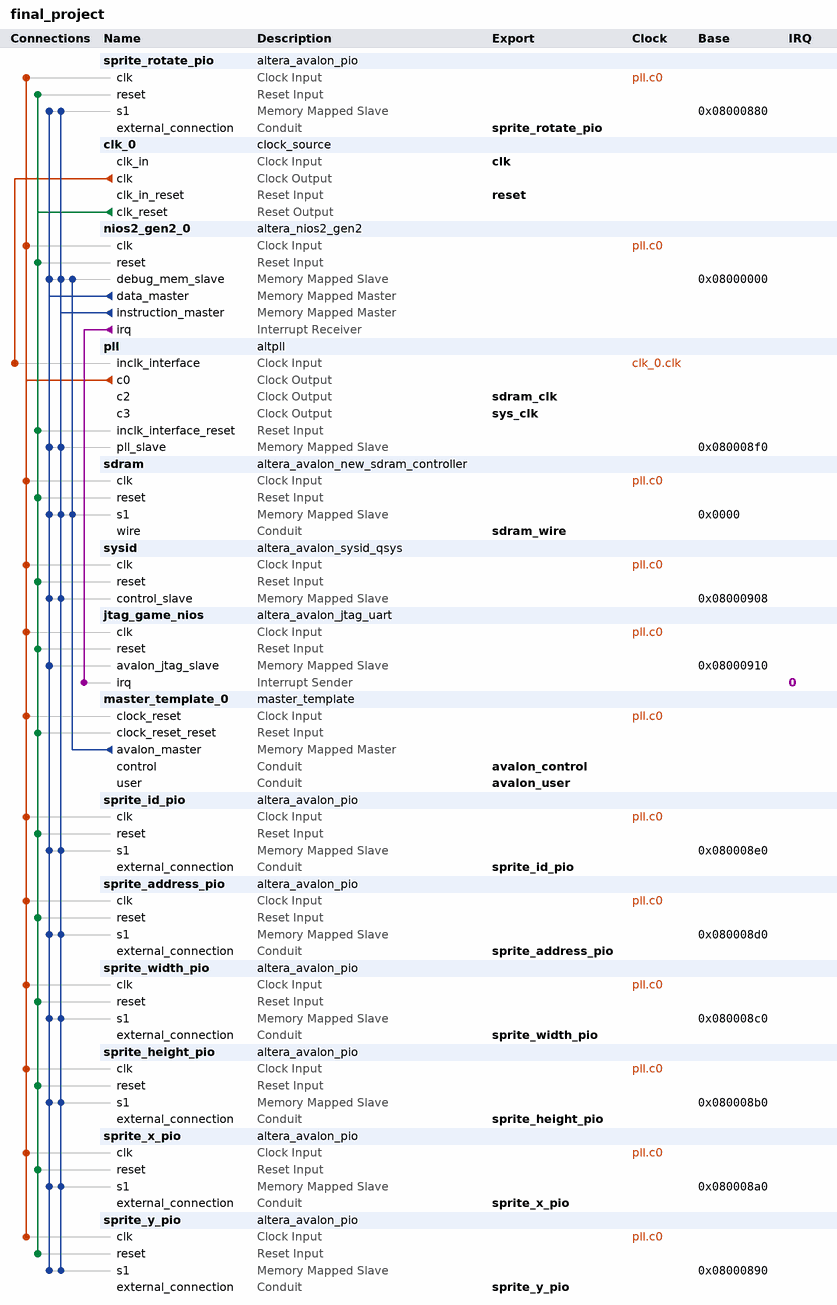
[diagram p0: system contents]
# Platform Designer (Qsys) system final_project, Cyclone IV E EP4CE115F29C7
# Parameters at their usual value, and those the tool derives, are not listed.
package require -exact qsys 18.1
create_system final_project
set_project_property DEVICE_FAMILY {Cyclone IV E}
set_project_property DEVICE EP4CE115F29C7

add_instance sprite_rotate_pio altera_avalon_pio 18.1
set_instance_parameter_value sprite_rotate_pio direction Output
set_instance_parameter_value sprite_rotate_pio width 8

add_instance clk_0 clock_source 18.1
set_instance_parameter_value clk_0 clockFrequency 50000000

add_instance nios2_gen2_0 altera_nios2_gen2 18.1
set_instance_parameter_value nios2_gen2_0 dcache_size 4096
set_instance_parameter_value nios2_gen2_0 exceptionSlave sdram.s1
set_instance_parameter_value nios2_gen2_0 icache_size 4096
set_instance_parameter_value nios2_gen2_0 impl Tiny
set_instance_parameter_value nios2_gen2_0 resetSlave sdram.s1

add_instance pll altpll 18.1
set_instance_parameter_value pll BANDWIDTH_TYPE LOW
set_instance_parameter_value pll CLK0_DIVIDE_BY 1
set_instance_parameter_value pll CLK0_MULTIPLY_BY 2
set_instance_parameter_value pll CLK1_DIVIDE_BY 2
set_instance_parameter_value pll CLK1_DUTY_CYCLE 50
set_instance_parameter_value pll CLK1_MULTIPLY_BY 3
set_instance_parameter_value pll CLK1_PHASE_SHIFT 0
set_instance_parameter_value pll CLK2_DIVIDE_BY 1
set_instance_parameter_value pll CLK2_DUTY_CYCLE 50
set_instance_parameter_value pll CLK2_MULTIPLY_BY 2
set_instance_parameter_value pll CLK2_PHASE_SHIFT -4000
set_instance_parameter_value pll CLK3_DIVIDE_BY 1
set_instance_parameter_value pll CLK3_DUTY_CYCLE 50
set_instance_parameter_value pll CLK3_MULTIPLY_BY 2
set_instance_parameter_value pll CLK3_PHASE_SHIFT 0
set_instance_parameter_value pll INCLK0_INPUT_FREQUENCY 20000
set_instance_parameter_value pll PORT_ARESET PORT_UNUSED
set_instance_parameter_value pll PORT_LOCKED PORT_UNUSED
set_instance_parameter_value pll PORT_clk1 PORT_USED
set_instance_parameter_value pll PORT_clk2 PORT_USED
set_instance_parameter_value pll PORT_clk3 PORT_USED

add_instance sdram altera_avalon_new_sdram_controller 18.1
set_instance_parameter_value sdram TAC 5.5
set_instance_parameter_value sdram TRCD 20.0
set_instance_parameter_value sdram TRP 20.0
set_instance_parameter_value sdram casLatency 3
set_instance_parameter_value sdram columnWidth 10
set_instance_parameter_value sdram dataWidth 32
set_instance_parameter_value sdram generateSimulationModel false
set_instance_parameter_value sdram model single_Micron_MT48LC4M32B2_7_chip
set_instance_parameter_value sdram numberOfBanks 4
set_instance_parameter_value sdram numberOfChipSelects 1
set_instance_parameter_value sdram powerUpDelay 200.0
set_instance_parameter_value sdram refreshPeriod 7.8125
set_instance_parameter_value sdram rowWidth 13

add_instance sysid altera_avalon_sysid_qsys 18.1
set_instance_parameter_value sysid id 0

add_instance jtag_game_nios altera_avalon_jtag_uart 18.1
set_instance_parameter_value jtag_game_nios simInteractiveOptions NO_INTERACTIVE_WINDOWS

add_instance master_template_0 master_template 1.0
set_instance_parameter_value master_template_0 ADDRESS_WIDTH 32
set_instance_parameter_value master_template_0 BURST_CAPABLE 1
set_instance_parameter_value master_template_0 DATA_WIDTH 8
set_instance_parameter_value master_template_0 FIFO_DEPTH 256
set_instance_parameter_value master_template_0 MASTER_DIRECTION 0
set_instance_parameter_value master_template_0 MAXIMUM_BURST_COUNT 128
set_instance_parameter_value master_template_0 MEMORY_BASED_FIFO 1

add_instance sprite_id_pio altera_avalon_pio 18.1
set_instance_parameter_value sprite_id_pio direction Output
set_instance_parameter_value sprite_id_pio width 16

add_instance sprite_address_pio altera_avalon_pio 18.1
set_instance_parameter_value sprite_address_pio direction Output
set_instance_parameter_value sprite_address_pio width 32

add_instance sprite_width_pio altera_avalon_pio 18.1
set_instance_parameter_value sprite_width_pio direction Output
set_instance_parameter_value sprite_width_pio width 16

add_instance sprite_height_pio altera_avalon_pio 18.1
set_instance_parameter_value sprite_height_pio direction Output
set_instance_parameter_value sprite_height_pio width 16

add_instance sprite_x_pio altera_avalon_pio 18.1
set_instance_parameter_value sprite_x_pio direction Output
set_instance_parameter_value sprite_x_pio width 16

add_instance sprite_y_pio altera_avalon_pio 18.1
set_instance_parameter_value sprite_y_pio direction Output
set_instance_parameter_value sprite_y_pio width 16

# connections
add_connection clk_0.clk pll.inclk_interface clock
add_connection pll.c0 jtag_game_nios.clk clock
add_connection pll.c0 master_template_0.clock_reset clock
add_connection pll.c0 nios2_gen2_0.clk clock
add_connection pll.c0 sdram.clk clock
add_connection pll.c0 sprite_address_pio.clk clock
add_connection pll.c0 sprite_height_pio.clk clock
add_connection pll.c0 sprite_id_pio.clk clock
add_connection pll.c0 sprite_rotate_pio.clk clock
add_connection pll.c0 sprite_width_pio.clk clock
add_connection pll.c0 sprite_x_pio.clk clock
add_connection pll.c0 sprite_y_pio.clk clock
add_connection pll.c0 sysid.clk clock
add_connection clk_0.clk_reset jtag_game_nios.reset reset
add_connection clk_0.clk_reset master_template_0.clock_reset_reset reset
add_connection clk_0.clk_reset nios2_gen2_0.reset reset
add_connection clk_0.clk_reset pll.inclk_interface_reset reset
add_connection clk_0.clk_reset sdram.reset reset
add_connection clk_0.clk_reset sprite_address_pio.reset reset
add_connection clk_0.clk_reset sprite_height_pio.reset reset
add_connection clk_0.clk_reset sprite_id_pio.reset reset
add_connection clk_0.clk_reset sprite_rotate_pio.reset reset
add_connection clk_0.clk_reset sprite_width_pio.reset reset
add_connection clk_0.clk_reset sprite_x_pio.reset reset
add_connection clk_0.clk_reset sprite_y_pio.reset reset
add_connection clk_0.clk_reset sysid.reset reset
add_connection master_template_0.avalon_master nios2_gen2_0.debug_mem_slave avalon
set_connection_parameter_value master_template_0.avalon_master/nios2_gen2_0.debug_mem_slave baseAddress 0x08000000
add_connection master_template_0.avalon_master sdram.s1 avalon
set_connection_parameter_value master_template_0.avalon_master/sdram.s1 baseAddress 0x0000
add_connection nios2_gen2_0.data_master jtag_game_nios.avalon_jtag_slave avalon
set_connection_parameter_value nios2_gen2_0.data_master/jtag_game_nios.avalon_jtag_slave baseAddress 0x08000910
add_connection nios2_gen2_0.data_master nios2_gen2_0.debug_mem_slave avalon
set_connection_parameter_value nios2_gen2_0.data_master/nios2_gen2_0.debug_mem_slave baseAddress 0x08000000
add_connection nios2_gen2_0.data_master pll.pll_slave avalon
set_connection_parameter_value nios2_gen2_0.data_master/pll.pll_slave baseAddress 0x080008f0
add_connection nios2_gen2_0.data_master sdram.s1 avalon
set_connection_parameter_value nios2_gen2_0.data_master/sdram.s1 baseAddress 0x0000
add_connection nios2_gen2_0.data_master sprite_address_pio.s1 avalon
set_connection_parameter_value nios2_gen2_0.data_master/sprite_address_pio.s1 baseAddress 0x080008d0
add_connection nios2_gen2_0.data_master sprite_height_pio.s1 avalon
set_connection_parameter_value nios2_gen2_0.data_master/sprite_height_pio.s1 baseAddress 0x080008b0
add_connection nios2_gen2_0.data_master sprite_id_pio.s1 avalon
set_connection_parameter_value nios2_gen2_0.data_master/sprite_id_pio.s1 baseAddress 0x080008e0
add_connection nios2_gen2_0.data_master sprite_rotate_pio.s1 avalon
set_connection_parameter_value nios2_gen2_0.data_master/sprite_rotate_pio.s1 baseAddress 0x08000880
add_connection nios2_gen2_0.data_master sprite_width_pio.s1 avalon
set_connection_parameter_value nios2_gen2_0.data_master/sprite_width_pio.s1 baseAddress 0x080008c0
add_connection nios2_gen2_0.data_master sprite_x_pio.s1 avalon
set_connection_parameter_value nios2_gen2_0.data_master/sprite_x_pio.s1 baseAddress 0x080008a0
add_connection nios2_gen2_0.data_master sprite_y_pio.s1 avalon
set_connection_parameter_value nios2_gen2_0.data_master/sprite_y_pio.s1 baseAddress 0x08000890
add_connection nios2_gen2_0.data_master sysid.control_slave avalon
set_connection_parameter_value nios2_gen2_0.data_master/sysid.control_slave baseAddress 0x08000908
add_connection nios2_gen2_0.instruction_master nios2_gen2_0.debug_mem_slave avalon
set_connection_parameter_value nios2_gen2_0.instruction_master/nios2_gen2_0.debug_mem_slave baseAddress 0x08000000
add_connection nios2_gen2_0.instruction_master pll.pll_slave avalon
set_connection_parameter_value nios2_gen2_0.instruction_master/pll.pll_slave baseAddress 0x080008f0
add_connection nios2_gen2_0.instruction_master sdram.s1 avalon
set_connection_parameter_value nios2_gen2_0.instruction_master/sdram.s1 baseAddress 0x0000
add_connection nios2_gen2_0.instruction_master sprite_address_pio.s1 avalon
set_connection_parameter_value nios2_gen2_0.instruction_master/sprite_address_pio.s1 baseAddress 0x080008d0
add_connection nios2_gen2_0.instruction_master sprite_height_pio.s1 avalon
set_connection_parameter_value nios2_gen2_0.instruction_master/sprite_height_pio.s1 baseAddress 0x080008b0
add_connection nios2_gen2_0.instruction_master sprite_id_pio.s1 avalon
set_connection_parameter_value nios2_gen2_0.instruction_master/sprite_id_pio.s1 baseAddress 0x080008e0
add_connection nios2_gen2_0.instruction_master sprite_rotate_pio.s1 avalon
set_connection_parameter_value nios2_gen2_0.instruction_master/sprite_rotate_pio.s1 baseAddress 0x08000880
add_connection nios2_gen2_0.instruction_master sprite_width_pio.s1 avalon
set_connection_parameter_value nios2_gen2_0.instruction_master/sprite_width_pio.s1 baseAddress 0x080008c0
add_connection nios2_gen2_0.instruction_master sprite_x_pio.s1 avalon
set_connection_parameter_value nios2_gen2_0.instruction_master/sprite_x_pio.s1 baseAddress 0x080008a0
add_connection nios2_gen2_0.instruction_master sprite_y_pio.s1 avalon
set_connection_parameter_value nios2_gen2_0.instruction_master/sprite_y_pio.s1 baseAddress 0x08000890
add_connection nios2_gen2_0.instruction_master sysid.control_slave avalon
set_connection_parameter_value nios2_gen2_0.instruction_master/sysid.control_slave baseAddress 0x08000908
add_connection nios2_gen2_0.irq jtag_game_nios.irq interrupt
set_connection_parameter_value nios2_gen2_0.irq/jtag_game_nios.irq irqNumber 0

# exported interfaces
add_interface avalon_control conduit end
set_interface_property avalon_control EXPORT_OF master_template_0.control
add_interface avalon_user conduit end
set_interface_property avalon_user EXPORT_OF master_template_0.user
add_interface clk clock sink
set_interface_property clk EXPORT_OF clk_0.clk_in
add_interface reset reset sink
set_interface_property reset EXPORT_OF clk_0.clk_in_reset
add_interface sdram_clk clock source
set_interface_property sdram_clk EXPORT_OF pll.c2
add_interface sdram_wire conduit end
set_interface_property sdram_wire EXPORT_OF sdram.wire
add_interface sprite_address_pio conduit end
set_interface_property sprite_address_pio EXPORT_OF sprite_address_pio.external_connection
add_interface sprite_height_pio conduit end
set_interface_property sprite_height_pio EXPORT_OF sprite_height_pio.external_connection
add_interface sprite_id_pio conduit end
set_interface_property sprite_id_pio EXPORT_OF sprite_id_pio.external_connection
add_interface sprite_rotate_pio conduit end
set_interface_property sprite_rotate_pio EXPORT_OF sprite_rotate_pio.external_connection
add_interface sprite_width_pio conduit end
set_interface_property sprite_width_pio EXPORT_OF sprite_width_pio.external_connection
add_interface sprite_x_pio conduit end
set_interface_property sprite_x_pio EXPORT_OF sprite_x_pio.external_connection
add_interface sprite_y_pio conduit end
set_interface_property sprite_y_pio EXPORT_OF sprite_y_pio.external_connection
add_interface sys_clk clock source
set_interface_property sys_clk EXPORT_OF pll.c3

set_interconnect_requirement {$system} qsys_mm.clockCrossingAdapter HANDSHAKE
set_interconnect_requirement {$system} qsys_mm.enableEccProtection FALSE
set_interconnect_requirement {$system} qsys_mm.insertDefaultSlave FALSE
set_interconnect_requirement {$system} qsys_mm.maxAdditionalLatency 1

save_system final_project.qsys
